# EasyEDA Pro project BLDC.eprj

# Schematic Schematic1
Create Date: 2022-09-29; Page Name: P1; Project Name: BLDC; Schematic Name: Schematic1; Update Date: 2022-09-29; Company: 嘉立创EDA; Page Size: A4; Version: V1.0
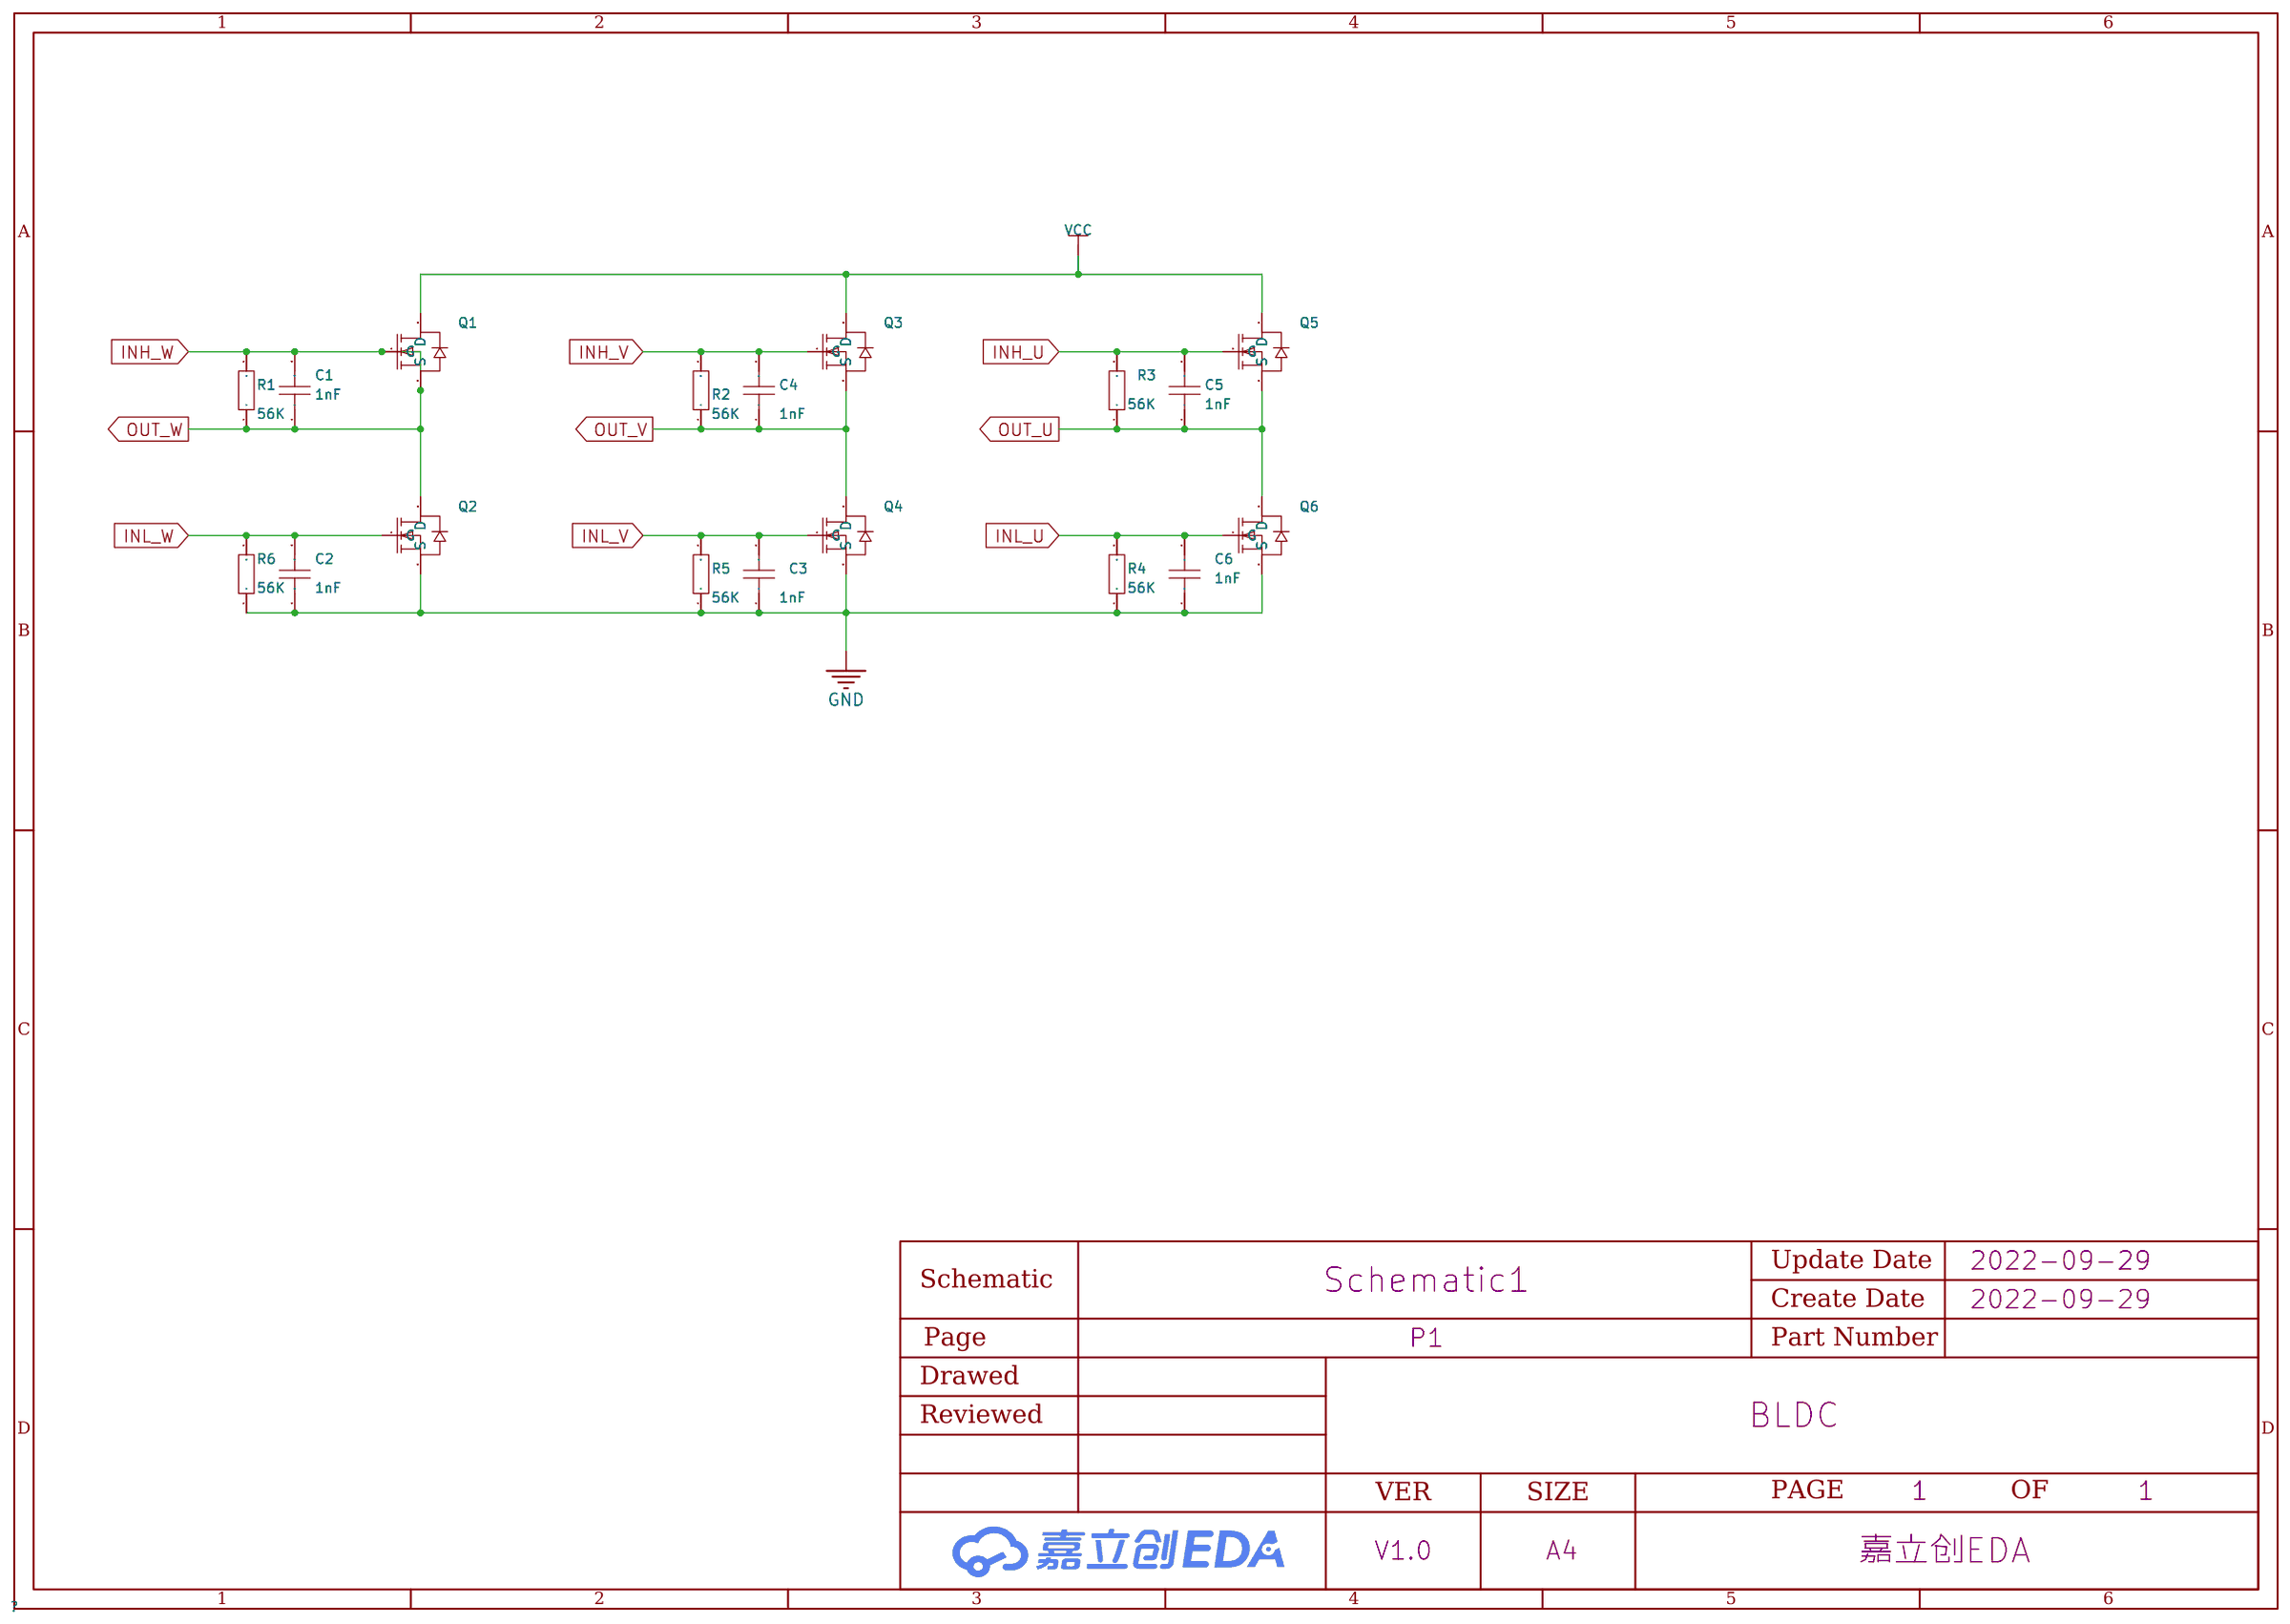
[diagram p0: schematic sheet]

## Parts
C1  1nF  [C0603]
C2  1nF  [C0603]
C3  1nF  [C0603]
C4  1nF  [C0603]
C5  1nF  [C0603]
C6  1nF  [C0603]
Q1  -  [SOT-23-3_L2.9-W1.3-P1.90-LS2.4-BR]
Q2  -  [SOT-23-3_L2.9-W1.3-P1.90-LS2.4-BR]
Q3  -  [SOT-23-3_L2.9-W1.3-P1.90-LS2.4-BR]
Q4  -  [SOT-23-3_L2.9-W1.3-P1.90-LS2.4-BR]
Q5  -  [SOT-23-3_L2.9-W1.3-P1.90-LS2.4-BR]
Q6  -  [SOT-23-3_L2.9-W1.3-P1.90-LS2.4-BR]
R1  56K  [R0603]
R2  56K  [R0603]
R3  56K  [R0603]
R4  56K  [R0603]
R5  56K  [R0603]
R6  56K  [R0603]

## Library data of the parts
C1-C6 = CAP_0603: Supplier Footprint: 0603
Q1-Q6 = AO3400A_N: 类型:N沟道;漏源电压(Vdss):30V;连续漏极电流(Id):5.2A;功率(Pd):1W;导通电阻(RDS(on)@Vgs,Id):35mΩ@10V,5A;阈值电压(Vgs(th)@Id):1.5V@250A;; Supplier Footprint: SOT-23; Supplier Part: C700953
R1-R6 = Res_0603: Supplier Footprint: 0603

## Nets
GND: C2.1 C3.1 C6.1 Q2.2(S) Q4.2(S) Q6.2(S) R4.1 R5.1 R6.1
VCC: Q1.3(D) Q3.3(D) Q5.3(D)
INH_U: C5.2 Q5.1(G) R3.2
INH_V: C4.2 Q3.1(G) R2.2
INH_W: C1.1 C1.2 Q1.1(G) Q1.2(S) Q2.3(D) R1.1 R1.2
INL_U: C6.2 Q6.1(G) R4.2
INL_V: C3.2 Q4.1(G) R5.2
INL_W: C2.2 Q2.1(G) R6.2
OUT_U: C5.1 Q5.2(S) Q6.3(D) R3.1
OUT_V: C4.1 Q3.2(S) Q4.3(D) R2.1
